# EAGLE design analog_inputs (EAGLE 9.0.1)
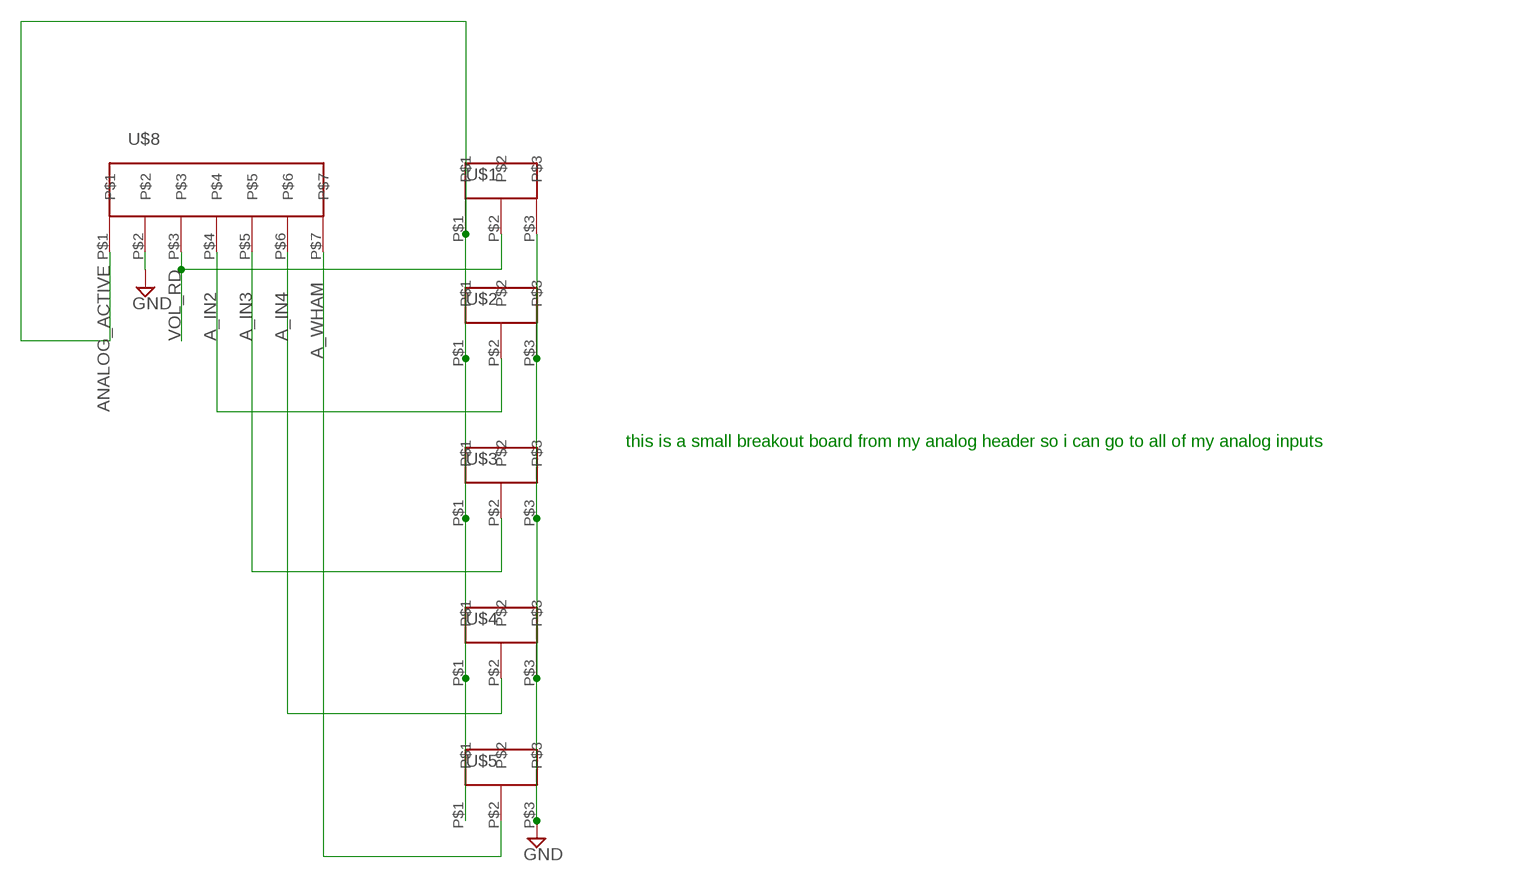
[diagram p0: schematic, sheet 1]

## Parts
U$1  3-PIN-HEADER  [3-PIN-HEADER]
U$2  3-PIN-HEADER  [3-PIN-HEADER]
U$3  3-PIN-HEADER  [3-PIN-HEADER]
U$4  3-PIN-HEADER  [3-PIN-HEADER]
U$5  3-PIN-HEADER  [3-PIN-HEADER]
U$8  7-PIN-HEADER  [7-PIN-HEADER]

## Nets
A_IN2: U$2.P$2 U$8.P$4
A_IN3: U$3.P$2 U$8.P$5
A_IN4: U$4.P$2 U$8.P$6
A_WHAM: U$5.P$2 U$8.P$7
ANALOG_ACTIVE: U$1.P$1 U$2.P$1 U$3.P$1 U$4.P$1 U$5.P$1 U$8.P$1
GND: U$1.P$3 U$2.P$3 U$3.P$3 U$4.P$3 U$5.P$3 U$8.P$2
VOL_RD: U$1.P$2 U$8.P$3

## Notes on the sheet
- this is a small breakout board from my analog header so i can go to all of my analog inputs

## Library data of the parts
U$1-U$5 = mask_lbr:3-PIN-HEADER
U$8 = mask_lbr:7-PIN-HEADER

## Net classes
0 default: width 0.508 mm, clearance 0.254 mm

## Board
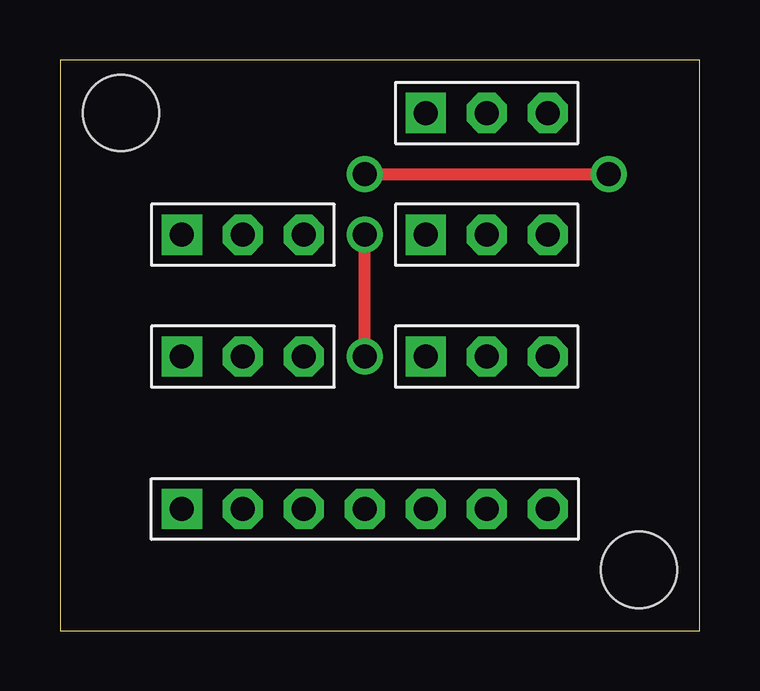
[diagram p1: board, top side]
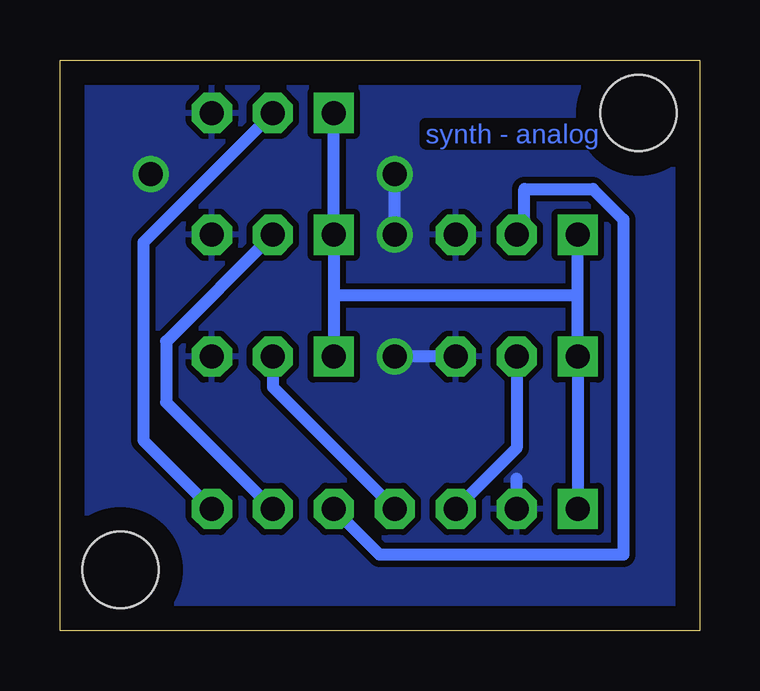
[diagram p2: board, bottom side, seen from below]

Size 26.65 x 23.8 mm. Coordinates in mm from the lower left corner, seen from the top.
Outline: 0,0 26.65,0 26.65,23.8 0,23.8 0,0
Copper layers (1*16): Top 0.035mm / dielectric 1.5mm / Bottom 0.035mm
Design rules "default": minimum track width 6mil, minimum drill 0.35mm, track to track 6mil, track to pad 6mil, pad to pad 6mil, via to via 6mil, smd to smd 6mil, copper to edge 40mil, drill to drill 6mil, minimum pad ring 10mil, minimum via ring 8mil, stop-mask expansion 4mil, vias tented up to drill 0mil, thermal gap 10mil
Holes 3.17 mm at 24.13,2.54 2.54,21.59

### Footprints (pad centres in the part's own frame; a part is rotated, then mirrored left to right if it is on the bottom)
3-PIN-HEADER = drill 1 pad 1.676 square: P$1 -2.54,0 | drill 1 pad 1.676 octagon: P$2 0,0; P$3 2.54,0
7-PIN-HEADER = drill 1 pad 1.676 square: P$1 -7.62,0 | drill 1 pad 1.676 octagon: P$2 -5.08,0; P$3 -2.54,0; P$4 0,0; P$5 2.54,0; P$6 5.08,0; P$7 7.62,0

### Placement (x,y rotation side)
U$1  7.62,11.43 0 top
U$2  17.78,11.43 0 top
U$3  7.62,16.51 0 top
U$4  17.78,16.51 0 top
U$5  17.78,21.59 0 top
U$8  12.7,5.08 0 top

### Tracks (layer width: path | path; a pad name or v marks a point on that pad's centre or on a via)
A_IN2
  Bottom 0.508: U$8.P$4 17.78,10.16 U$2.P$2
A_IN3
  Bottom 0.508: U$8.P$5 13.34,3.17 3.18,3.17 3.18,17.14 4.45,18.41 7.3,18.41 7.3,16.83 U$3.P$2
A_IN4
  Bottom 0.508: U$8.P$6 22.23,9.53 22.23,12.06 U$4.P$2
A_WHAM
  Bottom 0.508: U$8.P$7 23.18,7.94 23.18,16.19 U$5.P$2
ANALOG_ACTIVE
  Bottom 0.508: 15.24,13.97 U$4.P$1 U$5.P$1 | 15.24,13.97 U$2.P$1 | U$8.P$1 U$1.P$1 5.08,13.97 | 5.08,13.97 U$3.P$1 | 5.08,13.97 15.24,13.97
GND  (via drill 1)
  Top 0.508: v12.7,11.43 v12.7,16.51 | v12.7,19.05 v22.86,19.05
  Bottom 0.508: U$8.P$2 7.62,6.35 | U$1.P$3 v12.7,11.43 | v12.7,16.51 v12.7,19.05
  pour Bottom: 0,0 26.67,0 26.67,24.13 0,24.13
VOL_RD
  Bottom 0.508: U$8.P$3 7.62,7.62 U$1.P$2

### Text on the board
Bottom: synth - analog
Document: grounds are connected, but are they wide enough? yeah, very small currents...